# Altium schematic sheet Sheet2.SchDoc
size B; SheetNumber: 2; SheetTotal: 2
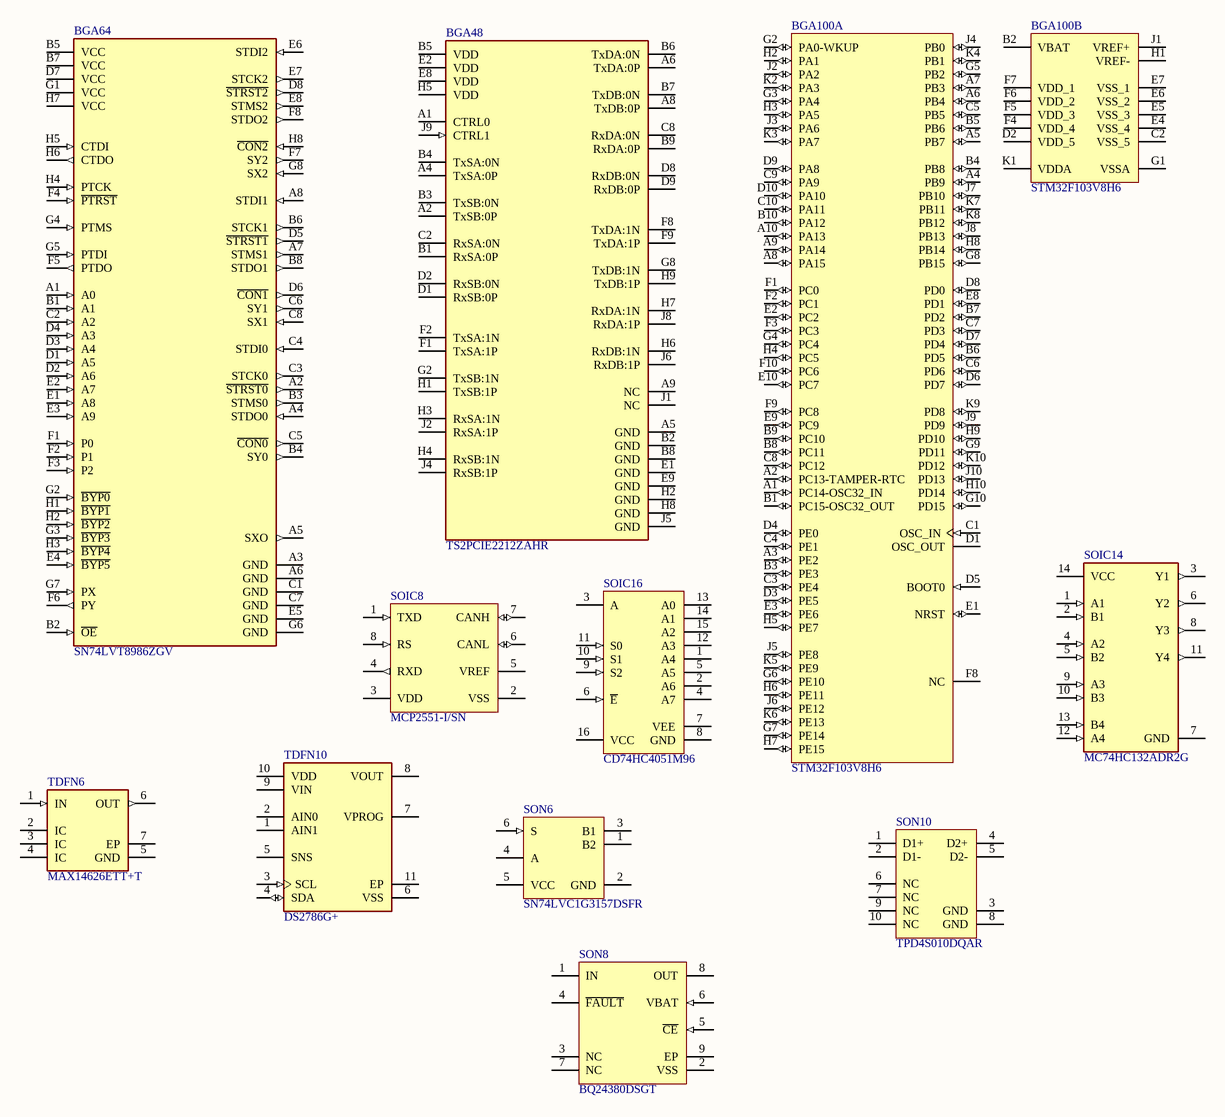
[diagram p0: Sheet2.SchDoc]

## Parts
BGA48  TS2PCIE2212ZAHR  [FP-ZAH0048A-MFG]
BGA64  SN74LVT8986ZGV  [FP-ZGV0064A-IPC_C]
BGA100  STM32F103V8H6  [STM-LFBGA100]  (parts A,B of 2)
SOIC8  MCP2551-I/SN  [MCHP-SN8_V]
SOIC14  MC74HC132ADR2G  [FP-751A-03-IPC_B]
SOIC16  CD74HC4051M96  [D0016A_M]
SON6  SN74LVC1G3157DSFR  [DSF0006A_V]
SON8  BQ24380DSGT  [DSG0008A_V]
SON10  TPD4S010DQAR  [DQA0010A_V]
TDFN6  MAX14626ETT+T  [FP-T633-2C-MFG]
TDFN10  DS2786G+  [FP-T1033-2-MFG]

## Nets

Not connected (* = marked no-connect by the designer): BGA48 A1(CTRL0) A2(TxSB:0P) A4(TxSA:0P) A5(GND) A6(TxDA:0P) A8(TxDB:0P) A9(NC) B1(RxSA:0P) B2(GND) B3(TxSB:0N) B4(TxSA:0N) B5(VDD) B6(TxDA:0N) B7(TxDB:0N) B8(GND) B9(RxDA:0P) C2(RxSA:0N) C8(RxDA:0N) D1(RxSB:0P) D2(RxSB:0N) D8(RxDB:0N) D9(RxDB:0P) E1(GND) E2(VDD) E8(VDD) E9(GND) F1(TxSA:1P) F2(TxSA:1N) F8(TxDA:1N) F9(TxDA:1P) G2(TxSB:1N) G8(TxDB:1N) H1(TxSB:1P) H2(GND) H3(RxSA:1N) H4(RxSB:1N) H5(VDD) H6(RxDB:1N) H7(RxDA:1N) H8(GND) H9(TxDB:1P) J1(NC) J2(RxSA:1P) J4(RxSB:1P) J5(GND) J6(RxDB:1P) J8(RxDA:1P) J9(CTRL1); BGA64 A1(A0) A2(~{STRST0}) A3(GND) A4(STDO0) A5(SXO) A6(GND) A7(STMS1) A8(STDI1) B1(A1) B2(~{OE}) B3(STMS0) B4(SY0) B5(VCC) B6(STCK1) B7(VCC) B8(STDO1) C1(GND) C2(A2) C3(STCK0) C4(STDI0) C5(~{CON0}) C6(SY1) C7(GND) C8(SX1) D1(A5) D2(A6) D3(A4) D4(A3) D5(~{STRST1}) D6(~{CON1}) D7(VCC) D8(~{STRST2}) E1(A8) E2(A7) E3(A9) E4(~{BYP5}) E5(GND) E6(STDI2) E7(STCK2) E8(STMS2) F1(P0) F2(P1) F3(P2) F4(~{PTRST}) F5(PTDO) F6(PY) F7(SY2) F8(STDO2) G1(VCC) G2(~{BYP0}) G3(~{BYP3}) G4(PTMS) G5(PTDI) G6(GND) G7(PX) G8(SX2) H1(~{BYP1}) H2(~{BYP2}) H3(~{BYP4}) H4(PTCK) H5(CTDI) H6(CTDO) H7(VCC) H8(~{CON2}); BGA100 A1(PC14-OSC32_IN) A2(PC13-TAMPER-RTC) A3(PE2) A4(PB9) A5(PB7) A6(PB4) A7(PB3) A8(PA15) A9(PA14) A10(PA13) B1(PC15-OSC32_OUT) B2(VBAT) B3(PE3) B4(PB8) B5(PB6) B6(PD5) B7(PD2) B8(PC11) B9(PC10) B10(PA12) C1(OSC_IN) C2(VSS_5) C3(PE4) C4(PE1) C5(PB5) C6(PD6) C7(PD3) C8(PC12) C9(PA9) C10(PA11) D1(OSC_OUT) D2(VDD_5) D3(PE5) D4(PE0) D5(BOOT0) D6(PD7) D7(PD4) D8(PD0) D9(PA8) D10(PA10) E1(NRST) E2(PC2) E3(PE6) E4(VSS_4) E5(VSS_3) E6(VSS_2) E7(VSS_1) E8(PD1) E9(PC9) E10(PC7) F1(PC0) F2(PC1) F3(PC3) F4(VDD_4) F5(VDD_3) F6(VDD_2) F7(VDD_1) F8(NC) F9(PC8) F10(PC6) G1(VSSA) G2(PA0-WKUP) G3(PA4) G4(PC4) G5(PB2) G6(PE10) G7(PE14) G8(PB15) G9(PD11) G10(PD15) H1(VREF-) H2(PA1) H3(PA5) H4(PC5) H5(PE7) H6(PE11) H7(PE15) H8(PB14) H9(PD10) H10(PD14) J1(VREF+) J2(PA2) J3(PA6) J4(PB0) J5(PE8) J6(PE12) J7(PB10) J8(PB13) J9(PD9) J10(PD13) K1(VDDA) K2(PA3) K3(PA7) K4(PB1) K5(PE9) K6(PE13) K7(PB11) K8(PB12) K9(PD8) K10(PD12); SOIC8 1(TXD) 2(VSS) 3(VDD) 4(RXD) 5(VREF) 6(CANL) 7(CANH) 8(RS); SOIC14 1(A1) 2(B1) 3(Y1) 4(A2) 5(B2) 6(Y2) 7(GND) 8(Y3) 9(A3) 10(B3) 11(Y4) 12(A4) 13(B4) 14(VCC); SOIC16 1(A4) 2(A6) 3(A) 4(A7) 5(A5) 6(~{E}) 7(VEE) 8(GND) 9(S2) 10(S1) 11(S0) 12(A3) 13(A0) 14(A1) 15(A2) 16(VCC); SON6 1(B2) 2(GND) 3(B1) 4(A) 5(VCC) 6(S); SON8 1(IN) 2(VSS) 3(NC) 4(~{FAULT}) 5(~{CE}) 6(VBAT) 7(NC) 8(OUT) 9(EP); SON10 1(D1+) 2(D1-) 3(GND) 4(D2+) 5(D2-) 6(NC) 7(NC) 8(GND) 9(NC) 10(NC); TDFN6 1(IN) 2(IC) 3(IC) 4(IC) 5(GND) 6(OUT) 7(EP); TDFN10 1(AIN1) 2(AIN0) 3(SCL) 4(SDA) 5(SNS) 6(VSS) 7(VPROG) 8(VOUT) 9(VIN) 10(VDD) 11(EP)

## Library data of the parts
BGA48 = CMP-04872-000138-1: IC PCI-EXPRESS SIGNAL SW 48NFBGA; Data Rate: 2.5Gbps; Logic Function: Multiplexer; Nominal Supply Current: 160uA; Throw Configuration: SPDT; Number of I/Os: 32; Min Supply Voltage: 1.7V; Bandwidth: 1.25GHz; On-State Resistance: 17R; Number of Bits: 2; Max Supply Voltage: 1.9V; Operating Supply Current: 300uA; Propagation Delay: 0.005ns; Supply Type: Single; Mount: Surface Mount; Number of Pins: 48; RoHS Compliant: Yes; Package Quantity: 1; Min Operating Temperature: 0°C; Case/Package: BGA; Termination: SMD/SMT; Max Operating Temperature: 85°C; Packaging: Tape and Reel; Lead Free: Lead Free; REACH SVHC: No SVHC
BGA64 = CMP-1587-00096-4: IC LINK ADDRSS SCAN-PORT 64-BGA; Logic Function: Transceiver; Operating Supply Voltage: 3.6V; Radiation Hardening: No; Series: 74LVT; Lead Free: Lead Free; Number of Pins: 64; Packaging: Tray; RoHS Compliant: Yes; Mount: Surface Mount; Case/Package: BGA; Min Operating Temperature: -40°C; Package Quantity: 348; Max Operating Temperature: 85°C
BGA100 = CMP-0237-00039-3: ARM Cortex-M3 32-bit MCU, 64 KB Flash, 20 KB Internal RAM, 80 I/Os, 100-pin LFBGA, -40 to 85 degC, Tray; FLASH Size (Prog) (kB): 64; Internal RAM Size (kB): 20; I/Os (High Current): 80; Operating Frequency(F) (Processor speed) (MHz): 72; Supply Voltage(Vcc) min (V): 2; A/D Converter: 2x12-bit (16 channel); Core: ARM Cortex-M3; PackageVersion: Rev. 8, 04/2011; ComponentLink1URL: http://www.st.com/web/en/home.html; ComponentLink3URL: http://www.st.com/st-web-ui/static/active/en/resource/technical/document/datasheet/CD00191185.pdf; PackageReference: LFBGA100; Mounting Technology: Surface Mount; PartNumber: STM32F103V8H6; ComponentLink2URL: http://www.st.com/st-web-ui/static/active/en/resource/technical/document/datasheet/CD00161566.pdf; ComponentLink2Description: Datasheet; DatasheetVersion: Rev. 16; ComponentLink3Description: Package Specification; Packing: Tray; PackageDescription: 100-Ball Low Profile Fine Pitch BGA, 10 x 10 x 1.7 mm Body, 0.8 mm Pitch; ComponentLink1Description: Manufacturer URL
SOIC8 = CMP-0186-00138-3: High-Speed CAN Transceiver, / 1 Mb/s, 4.5 to 5.5 V, 8-Pin SOIC (SN), Industrial Temperature, RoHS, Tube; Manufacturer: Microchip; RoHSCompliant: true; PackageReference: SN8; ComponentLink1URL: http://www.microchip.com/; DatasheetVersion: Rev. F, 07/2010; ComponentLink2Description: Datasheet; ComponentLink2URL: http://ww1.microchip.com/downloads/en/DeviceDoc/21667f.pdf; ComponentLink3Description: Package Specification; PackageDescription: 8-Pin Small Outline Integrated Circuit, Body 4.9 x 3.9 mm, Pitch 1.27 mm; ComponentLink1Description: Manufacturer URL; Mounting Technology: Surface Mount; ComponentLink3URL: http://www.microchip.com/stellent/groups/techpub_sg/documents/packagingspec/en012702.pdf
SOIC14 = CMP-07114-000023-1: IC GATE NAND SCHMITT 4CH 14SOIC; Number of Circuits: 4; Quiescent Current: 1uA; Output Current: 5.2mA; Number of Inputs: 2; Propagation Delay: 190ns; Turn-On Delay Time: 125ns; Schmitt Trigger Input: Yes; Number of Outputs: 1; Min Supply Voltage: 2V; Max Supply Voltage: 6V; High Level Output Current: -5.2mA; Lead Free: Lead Free; Number of Gates: 4; Length: 8.75mm; Contact Plating: Tin; Low Level Output Current: 5.2mA; Height: 1.5mm; Number of Elements: 4; Max Operating Temperature: 125°C; Min Operating Temperature: -55°C; REACH SVHC: No SVHC; Package Quantity: 2500; Mount: Surface Mount; Width: 4mm; Logic Function: NAND; Packaging: Tape and Reel; Halogen Free: Halogen Free; Case/Package: SOIC; Radiation Hardening: No; Number of Pins: 14
SOIC16 = CMP-1575-00036-4: High Speed CMOS 8-Channel Analog Multiplexer/Demultiplexer, D0016A, LARGE T&R; Manufacturer: Texas Instruments; Crosstalk: Yes; Ron(Max)(Ohms): 130; VCC(Min)(V): 2; Bandwidth(Max)(MHz): 180; VCC(Max)(V): 6; Rating: Catalog; Configuration: 1 X 1：8 MUX; Ron(Typ)(Ohms): 45; Generic Part Number: CD74HC4051; Output Type: CMOS; Operating Temperature Range(C): -55 to 125; DatasheetVersion: SCHS122J; Code_JEDEC: MS-012 variation AC; PackageReference: D0016A; PackageVersion: http://www.ti.com/lit/ml/mpds178g/mpds178g.pdf
SON6 = CMP-0859-00927-3: Single-Pole, Double-Throw Analog Switch, DSF0006A, LARGE T&R; Manufacturer: Texas Instruments; Channels(#): 1; Voltage(Nom)(V): 1.8,2.5,3.3,5; Mux Configuration: 1：2; VCC(Min)(V): 1.65; Rating: Catalog; Output Type: CMOS; Input Type: CMOS/TTL; Switch Configuration: SPDT; 3-State Output: No; Output Drive (IOL/IOH)(Max)(mA): 32/-32; tpd @ Nom Voltage(Max)(ns): 2,1.2,0.8,0.3; ICC @ Nom Voltage(Max)(mA): 0.01; Logic: True; F @ Nom Voltage(Max)(Mhz): 150; VCC(Max)(V): 5.5; Technology Family: LVC; Sub-Family: Analog Switch; DatasheetVersion: SCES424H; Bits(#): 1; Generic Part Number: SN74LVC1G3157; PackageReference: DSF0006A; Schmitt Trigger: No; Operating Temperature Range(C): -40 to 85
SON8 = CMP-0321-00485-2: Overvoltage / Overcurrent Protection IC and Li+ Charger Front End Protection IC with LDO Mode, 6.3 OVP, -40 to 125 degC, 8-pin WSON (DSG), Green (RoHS & no Sb/Br); Manufacturer: Texas Instruments; Li-Ion: N; Mounting Technology: Surface Mount; Code_JEDEC: MO-229; ComponentLink1Description: Datasheet; PackageDescription: 8-Pin Plastic Small Outline No-Lead, 2 x 2 x 0.8 mm Body, 0.5 mm Pitch, Exposed Pad; Eco-Plan: Green (RoHS & no Sb/Br); ComponentLink1URL: http://www.ti.com/general/docs/lit/getliterature.tsp?genericPartNumber=BQ24380&fileType=pdf; Li-Polymer: N; DatasheetVersion: SLUS805B; NiCd: N; Lead Acid: N; SubFamily: Charger Front End Protection; Over Voltage Protection: N; PackageVersion: revB, Oct-2010; PartNumber: BQ24380DSGT; PackageReference: DSG0008A; NiMH: N
SON10 = CMP-0326-00026-3: ESD Solution for High-Speed Differential Interface, 4 Channels, -40 to +85 degC,10-pin SON (DQA), Green (RoHS & no Sb/Br); Manufacturer: Texas Instruments; Differential Capacitance(pF): 0.05; IEC 61000-4-2 Contact(+/- kV): 8; IO Capacitance(Typ)(pF): 0.8; Breakdown Voltage(Min)(V): 9; Serial ATA / eSATA: TRUE; IO Leakage Current(nA): 10; PackageVersion: revB, Sep-2009; ComponentLink2Description: Datasheet; ComponentLink3URL: SamplesURL:http://www.ti.com/product/tpd4s010#samples; ComponentLink2URL: http://www.ti.com/general/docs/lit/getliterature.tsp?genericPartNumber=TPD4S010&fileType=pdf; Mounting Technology: Surface Mount; IEC 61000-4-2 Air-Gap(+/- kV): 9; PartNumber: TPD4S010DQAR; ComponentLink3Description: URL Link1; DatasheetVersion: SLVS817E; ComponentLink1Description: Manufacturer URL; PackageDescription: 10-Pin Plastic Small Outline No-Lead, 1 x 2.5 x 0.55 mm Body, 0.5 mm Pitch; Eco-Plan: Green (RoHS & no Sb/Br); ComponentLink1URL: http://www.ti.com/; PackageReference: DQA0010A; SubFamily: ESD Solution; 1394 / Firewire: TRUE
TDFN6 = CMP-05687-000001-1: IC CURR LOOP PROT 4-20MA 6TDFN; Manufacturer: Maxim Integrated; Standoff Height: 0mm; Max Junction Temp: +150°C; Nominal Supply Current: 40uA; Min Supply Voltage: 2.3V; Sensor Output: Analog Voltage; Sensor Input: Analog Current; Max Supply Voltage: 40V; Interface: 2-Wire,Other; Footprint Url: https://pdfserv.maximintegrated.com/land_patterns/90-0058.PDF; Temperature Range Low: -40°C; Category: IC; Octopart: https://octopart.com/max14626ett%2Bt-maxim+integrated-22619755; Mouser Description: IC CURR LOOP PROT 4-20MA 6TDFN; Temperature: -40°C to +85°C; ComponentLink2Description: Datasheet; Ipc Land Pattern Name: DFN300X300X75-6; Package: T633-2C; RoHS: TRUE; Device Class L3: Sensor and Detector Interfaces; Temperature Range High: +85°C; Device Class L2: Interface ICs; Digikey Description: IC CURR LOOP PROT 4-20MA 6TDFN; Height: 0.8mm; Manufacturer Part Number: MAX14626ETT+T; Device Class L1: Integrated Circuits (ICs); ComponentLink2URL: https://datasheets.maximintegrated.com/en/ds/MAX14626.pdf; Automotive: No; Lead Free: Yes
TDFN10 = CMP-05715-000076-1: IC FUEL GAUGE OCV 10-TDFN; Manufacturer: Maxim Integrated; Min Supply Voltage: 2.5V; Standoff Height: 0mm; Number Of Cells: 3; Description: Battery Battery Monitor IC Lithium Ion/Polymer 10-TDFN-EP (3x3); Max Supply Voltage: 15.5V; Nominal Supply Current: 50uA; Mouser Description: Battery Management Stand-Alone OCV Based Fuel Gauge; RoHS: TRUE; Temperature: -20°C to +70°C; Category: IC; Temperature Range High: +70°C; Octopart: https://octopart.com/ds2786g%2B-maxim+integrated-42201102; Package: T1033-2; Device Class L1: Integrated Circuits (ICs); Device Class L2: Power Management ICs; Height: 0.8mm; ComponentLink2Description: Datasheet; Device Class L3: Battery Management; Digikey Description: IC FUEL GAUGE OCV 10-TDFN; Automotive: No; Lead Free: Yes; Manufacturer Part Number: DS2786G+; ComponentLink2URL: https://datasheets.maximintegrated.com/en/ds/DS2786.pdf; Temperature Range Low: -20°C; Footprint Url: https://pdfserv.maximintegrated.com/package_dwgs/21-0137.PDF